# EAGLE schematic scheme (EAGLE 7.3.0)
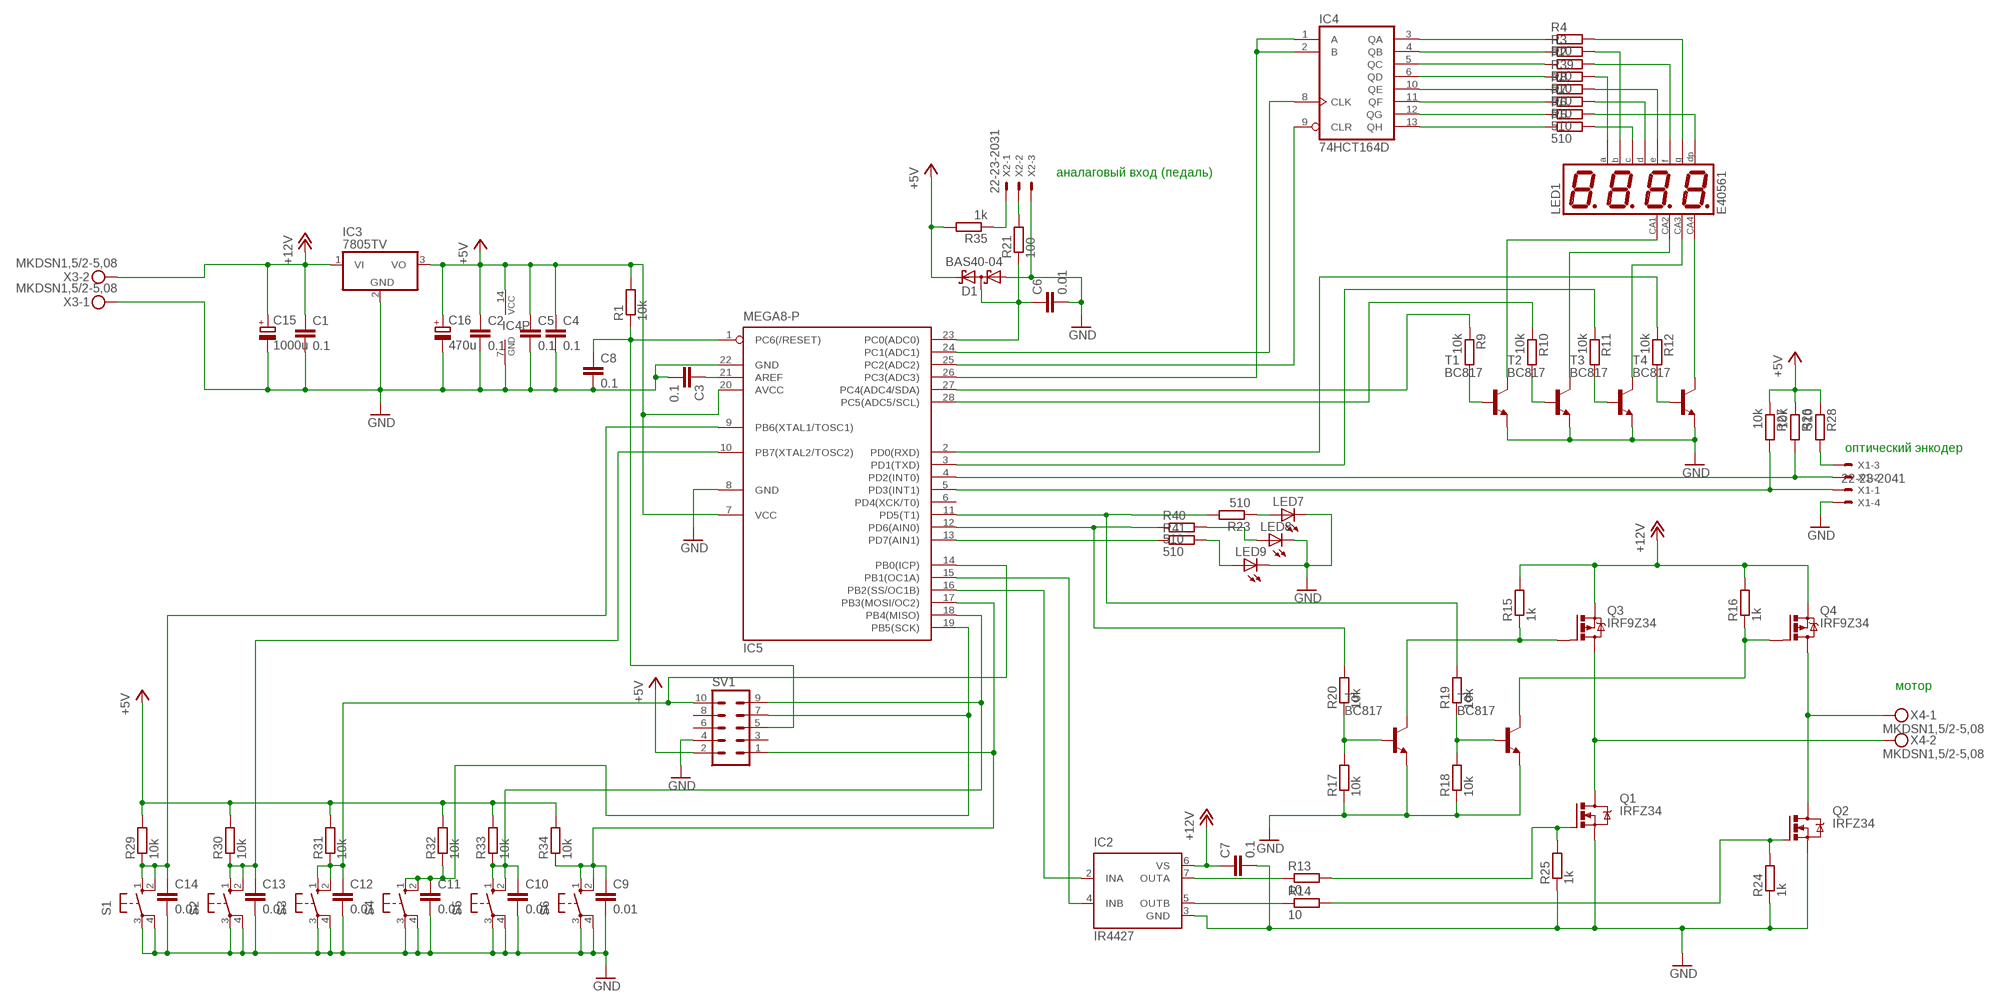
[diagram p0: schematic, sheet 1]

## Parts
C1  0.1  C-EUC0805  [C0805]
C2  0.1  C-EUC0805  [C0805]
C3  0.1  C-EUC0805  [C0805]
C4  0.1  C-EUC0805  [C0805]
C5  0.1  C-EUC0805  [C0805]
C6  0.01  C-EUC0805  [C0805]
C7  0.1  C-EUC0805  [C0805]
C8  0.1  C-EUC0805  [C0805]
C9  0.01  C-EUC0805  [C0805]
C10  0.01  C-EUC0805  [C0805]
C11  0.01  C-EUC0805  [C0805]
C12  0.01  C-EUC0805  [C0805]
C13  0.01  C-EUC0805  [C0805]
C14  0.01  C-EUC0805  [C0805]
C15  1000u  CPOL-EUE3.5-10  [E3,5-10]
C16  470u  CPOL-EUE3.5-10  [E3,5-10]
D1  BAS40-04  [SOT23]
IC2  IR4427  [DIL08]
IC3  7805TV  [TO220V]
IC4  74HCT164D  [SO14]
IC5  MEGA8-P  [DIL28-3]
LED1  E40561  BA56-12EWA  [BX56-12]
LED7  LED5MM  [LED5MM]
LED8  LED5MM  [LED5MM]
LED9  LED5MM  [LED5MM]
Q1  IRFZ34  IRF530  [TO220BV]
Q2  IRFZ34  IRF530  [TO220BV]
Q3  IRF9Z34  IRF9530  [TO220BV]
Q4  IRF9Z34  IRF9530  [TO220BV]
R1  10k  R-EU_R0805  [R0805]
R2  510  R-EU_R0805  [R0805]
R3  R-EU_R0805  [R0805]
R4  510  R-EU_R0805  [R0805]
R5  510  R-EU_R0805  [R0805]
R6  510  R-EU_R0805  [R0805]
R7  510  R-EU_R0805  [R0805]
R8  510  R-EU_R0805  [R0805]
R9  10k  R-EU_R0805  [R0805]
R10  10k  R-EU_R0805  [R0805]
R11  10k  R-EU_R0805  [R0805]
R12  10k  R-EU_R0805  [R0805]
R13  10  R-EU_R0805  [R0805]
R14  10  R-EU_R0805  [R0805]
R15  1k  R-EU_R0805  [R0805]
R16  1k  R-EU_R0805  [R0805]
R17  10k  R-EU_R0805  [R0805]
R18  10k  R-EU_R0805  [R0805]
R19  10k  R-EU_R0805  [R0805]
R20  10k  R-EU_R0805  [R0805]
R21  100  R-EU_R0805  [R0805]
R23  510  R-EU_R0805  [R0805]
R24  1k  R-EU_R0805  [R0805]
R25  1k  R-EU_R0805  [R0805]
R26  10k  R-EU_R0805  [R0805]
R27  10k  R-EU_R0805  [R0805]
R28  510  R-EU_R0805  [R0805]
R29  10k  R-EU_R0805  [R0805]
R30  10k  R-EU_R0805  [R0805]
R31  10k  R-EU_R0805  [R0805]
R32  10k  R-EU_R0805  [R0805]
R33  10k  R-EU_R0805  [R0805]
R34  10k  R-EU_R0805  [R0805]
R35  1k  R-EU_R0805  [R0805]
R39  510  R-EU_R0805  [R0805]
R40  510  R-EU_R0805  [R0805]
R41  510  R-EU_R0805  [R0805]
S1  40-XX  [B3F-40XX]
S2  40-XX  [B3F-40XX]
S3  40-XX  [B3F-40XX]
S4  40-XX  [B3F-40XX]
S5  40-XX  [B3F-40XX]
S6  40-XX  [B3F-40XX]
SV1  ML10  [ML10]
T1  BC817  BC817-16-NPN-SOT23-BEC  [SOT23-BEC]
T2  BC817  BC817-16-NPN-SOT23-BEC  [SOT23-BEC]
T3  BC817  BC817-16-NPN-SOT23-BEC  [SOT23-BEC]
T4  BC817  BC817-16-NPN-SOT23-BEC  [SOT23-BEC]
T5  BC817  BC817-16-NPN-SOT23-BEC  [SOT23-BEC]
T6  BC817  BC817-16-NPN-SOT23-BEC  [SOT23-BEC]
X1  22-23-2041  [22-23-2041]
X2  22-23-2031  [22-23-2031]
X3  MKDSN1,5/2-5,08  [MKDSN1,5/2-5,08]
X4  MKDSN1,5/2-5,08  [MKDSN1,5/2-5,08]

## Nets
+5V: C2.1 C4.1 C5.1 C16.+ D1.2(C2) IC3.3(VO) IC4.14(VCC) IC5.7(VCC) IC5.20(AVCC) R1.2 R26.1 R27.1 R28.1 R29.2 R30.2 R31.2 R32.2 R33.2 R34.2 R35.2 SV1.2
+12V: C1.1 C7.1 C15.+ IC2.6(VS) IC3.1(VI) Q3.S Q4.S R15.2 R16.2 X3.2
GND: C1.2 C2.2 C3.2 C4.2 C5.2 C6.2 C7.2 C8.2 C9.2 C10.2 C11.2 C12.2 C13.2 C14.2 C15.- C16.- D1.1(A1) IC2.3(GND) IC3.2(GND) IC4.7(GND) IC5.8(GND) IC5.22(GND) LED7.K(C) LED8.K(C) LED9.K(C) Q1.S Q2.S R17.1 R18.1 R24.1 R25.1 S1.3(P) S1.4(P1) S2.3(P) S2.4(P1) S3.3(P) S3.4(P1) S4.3(P) S4.4(P1) S5.3(P) S5.4(P1) S6.3(P) S6.4(P1) SV1.4 T1.E T2.E T3.E T4.E T5.E T6.E X1.4 X2.3 X3.1
N$1: IC5.13(PD7(AIN1))
N$2: R28.2 X1.3
N$3: R10.2 T2.B
N$4: R11.2 T3.B
N$5: R12.2 T4.B
N$6: LED1.6(CA) T4.C
N$7: LED1.8(CA) T3.C
N$8: LED1.9(CA) T2.C
N$9: C6.1 D1.3(C1A2) IC5.23(PC0(ADC0)) R21.1
N$10: LED1.12(CA) T1.C
N$11: R40.1
N$12: R41.1
N$13: LED1.1(E) R8.2
N$14: IC4.6(QD) R39.1
N$15: IC4.5(QC) R2.1
N$16: IC4.4(QB) R3.1
N$17: LED1.2(D) R7.2
N$18: LED1.3(DP) R6.2
N$19: LED1.4(C) R5.2
N$20: LED1.5(G) R4.2
N$21: LED1.7(B) R3.2
N$22: LED1.10(F) R2.2
N$23: LED1.11(A) R39.2
N$25: IC5.5(PD3(INT1)) R27.2 X1.1
N$26: IC5.4(PD2(INT0)) R26.2 X1.2
N$27: C13.1 IC5.10(PB7(XTAL2/TOSC2)) R30.1 S2.1(S) S2.2(S1)
N$28: IC5.28(PC5(ADC5/SCL)) R10.1
N$29: IC5.27(PC4(ADC4/SDA)) R9.1
N$31: IC4.3(QA) R4.1
N$32: Q4.G R16.1 T6.C
N$33: Q3.G R15.1 T5.C
N$34: R17.2 R20.1 T5.B
N$35: R18.2 R19.1 T6.B
N$36: R21.2 X2.2
N$37: Q1.D Q3.D X4.2
N$38: Q2.D Q4.D X4.1
N$39: Q1.G R13.2 R25.2
N$40: Q2.G R14.2 R24.2
N$41: IC2.7(OUTA) R13.1
N$42: IC2.5(OUTB) R14.1
N$43: IC2.4(INB) IC5.15(PB1(OC1A))
N$46: C8.1 IC5.1(PC6(/RESET)) R1.1 SV1.5
N$47: R35.1 X2.1
N$49: C10.1 IC5.18(PB4(MISO)) R33.1 S5.1(S) S5.2(S1) SV1.9
N$50: IC4.10(QE) R8.1
N$51: IC4.11(QF) R7.1
N$52: C3.1 IC5.21(AREF)
N$53: LED7.A R23.1
N$55: IC4.12(QG) R6.1
N$56: IC5.11(PD5(T1)) R19.2
N$57: IC5.12(PD6(AIN0)) R20.2
N$58: IC4.1(A) IC4.2(B) IC5.26(PC3(ADC3))
N$59: IC4.9(CLR) IC5.25(PC2(ADC2))
N$60: IC5.3(PD1(TXD)) R11.1
N$62: IC5.2(PD0(RXD)) R12.1
N$63: IC4.13(QH) R5.1
N$65: LED8.A R40.2
N$66: LED9.A R41.2
N$68: R9.2 T1.B
N$71: IC4.8(CLK) IC5.24(PC1(ADC1))
N$76: IC2.2(INA) IC5.16(PB2(SS/OC1B))
N$77: C11.1 IC5.19(PB5(SCK)) R32.1 S4.1(S) S4.2(S1) SV1.7
N$79: C14.1 IC5.9(PB6(XTAL1/TOSC1)) R29.1 S1.1(S) S1.2(S1)
N$80: C9.1 IC5.17(PB3(MOSI/OC2)) R34.1 S6.1(S) S6.2(S1) SV1.1
N$83: C12.1 IC5.14(PB0(ICP)) R31.1 S3.1(S) S3.2(S1) SV1.10
N$85: R23.2
Unconnected: IC5.6(PD4(XCK/T0)) SV1.3 SV1.6 SV1.8

## Notes on the sheet
- аналаговый вход (педаль)
- оптический энкодер
- мотор

## Library data of the parts
C1-C14 = rcl:C-EU: CAPACITOR, European symbol
C15 C16 = rcl:CPOL-EU: POLARIZED CAPACITOR, European symbol
D1 = diode:BAS40-04: Silicon Schottky Diodes General-purpose diode for high-speed switching
IC2 = ir:IR4427: DUAL LOW SIDE DRIVER Source: ID4426.pdf; MF: INTERNATIONAL RECTIFIER(IR); MPN: IR4427; OC_FARNELL: 1023267; OC_NEWARK: 27C6914
IC3 = linear:78*: Positive VOLTAGE REGULATOR Source: http://cache.national.com/ds/LM/LM78L05.pdf http://www.fairchildsemi.com/ds/LM/LM7805.pdf
IC4 = 74xx-eu:74*164: 8-bit parallel out SHIFT REGISTER
IC5 = atmel:MEGA8-P: MICROCONTROLLER 8 Kbytes FLASH, 1 kbytes SRAM, 512 bytes EEPROM, USART, 4-channel 10 bit ADC, 2-channel 8 bit ADC Pin compatible with Atmega48, ATMega88, ATMega168 Source: avr.lbr; OC_FARNELL: unknown; OC_NEWARK: unknown
LED1 = winder:B?56-12*WA: 14.22mm (0.56INCH) THREE DIGIT NUMERIC DISPLAY Source: http://www.kingbright.com .. BA56-11EWA(Ver1189474895.pdf; OC_FARNELL: unknown; OC_NEWARK: unknown
LED7-LED9 = led:LED: LED OSRAM: - CHIPLED LG R971, LG N971, LY N971, LG Q971, LY Q971, LO R971, LY R971 LH N974, LH R974 LS Q976, LO Q976, LY Q976 LO Q996 - Hyper CHIPLED LW Q18S LB Q993, LB Q99A, LB R99A - SideLED LS A670, LO A670, LY A670, LG A670, LP A670 LB A673, LV A673, LT A673, LW A673 LH A674 LY A675 LS A676, LA A676, LO A676, LY A676, LW A676 LS A679, LY A679, LG A679 - Hyper Micro SIDELED® LS Y876, LA Y876, LO Y876, LY Y876 LT Y87S - SmartLED LW L88C, LW L88S LB L89C, LB L89S, LG L890 LS L89K, LO L89K, LY L89K LS L896, LA L896, LO L896, LY L896 - TOPLED LS T670, LO T670, LY T670, LG T670, LP T670 LSG T670, LSP T670, LSY T670, LOP T670, LYG T670 LG T671, LOG T671, LSG T671 LB T673, LV T673, LT T673, LW T673 LH T674 LS T676, LA T676, LO T676, LY T676, LB T676, LH T676, LSB T676, LW T676 LB T67C, LV T67C, LT T67C, LS T67K, LO T67K, LY T67K, LW E67C LS E67B, LA E67B, LO E67B, LY E67B, LB E67C, LV E67C, LT E67C LW T67C LS T679, LY T679, LG T679 LS T770, LO T770, LY T770, LG T770, LP T770 LB T773, LV T773, LT T773, LW T773 LH T774 LS E675, LA E675, LY E675, LS T675 LS T776, LA T776, LO T776, LY T776, LB T776 LHGB T686 LT T68C, LB T68C - Hyper Mini TOPLED® LB M676 - Mini TOPLED Santana® LG M470 LS M47K, LO M47K, LY M47K Source: http://www.osram.convergy.de LUXEON: - LUMILED® LXK2-PW12-R00, LXK2-PW12-S00, LXK2-PW14-U00, LXK2-PW14-V00 LXK2-PM12-R00, LXK2-PM12-S00, LXK2-PM14-U00 LXK2-PE12-Q00, LXK2-PE12-R00, LXK2-PE12-S00, LXK2-PE14-T00, LXK2-PE14-U00 LXK2-PB12-K00, LXK2-PB12-L00, LXK2-PB12-M00, LXK2-PB14-N00, LXK2-PB14-P00, LXK2-PB14-Q00 LXK2-PR12-L00, LXK2-PR12-M00, LXK2-PR14-Q00, LXK2-PR14-R00 LXK2-PD12-Q00, LXK2-PD12-R00, LXK2-PD12-S00 LXK2-PH12-R00, LXK2-PH12-S00 LXK2-PL12-P00, LXK2-PL12-Q00, LXK2-PL12-R00 Source: www.luxeon.com KINGBRIGHT: KA-3528ASYC Source: www.kingbright.com
Q1 Q2 = transistor-power:IRF530: HEXFET Power MOSFET
Q3 Q4 = transistor-power:IRF9530: P-CHANNEL HEXFET POWER-MOS-FET Source: http://www.irf.com/product-info/datasheets/data/irf9530.pdf
R1-R21 R23-R35 R39-R41 = rcl:R-EU_: RESISTOR, European symbol
S1-S6 = switch-omron:40-XX: OMRON SWITCH; MF: OMRON COMPONENTS USA; MPN: B3F-4000; OC_FARNELL: 176434; OC_NEWARK: 36K3105
SV1 = con-ml:ML10: HARTING; OC_FARNELL: unknown; OC_NEWARK: unknown
T1-T6 = transistor:*-NPN-: NPN Transistror BF959 corrected 2008.03.06
X1 = con-molex:22-23-2041: .100" (2.54mm) Center Header - 4 Pin; MF: MOLEX; MPN: 22-23-2041; OC_FARNELL: 1462920; OC_NEWARK: 38C0355
X2 = con-molex:22-23-2031: .100" (2.54mm) Center Header - 3 Pin; MF: MOLEX; MPN: 22-23-2031; OC_FARNELL: 1462950; OC_NEWARK: 30C0862
X3 X4 = con-phoenix-508:MKDSN1,5/2-5,08: MKDSN 1,5/ 2-5,08 Printklemme Nennstrom: 13,5 A Nennspannung: 250 V Rastermaß: 5,08 mm Polzahl: 2 Anschlussart: Schraubanschluss Montage: Löten Anschlussrichtung Leiter/Platine: 0 ° Artikelnummer: 1729128 Source: http://eshop.phoenixcontact.com .. 1729128.pdf